# EAGLE schematic PotBreakout (EAGLE 6.5.0)
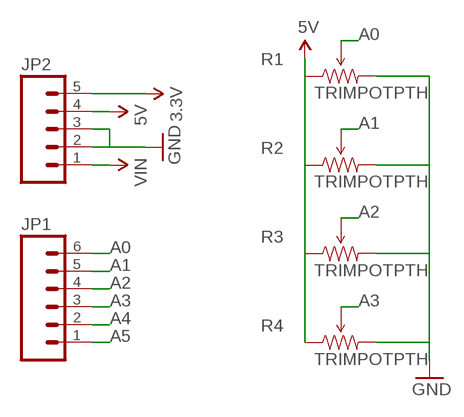
[diagram p0: schematic, sheet 1]

## Parts
JP1  M06SIP  [1X06]
JP2  M05NO_SILK  [1X05_NO_SILK]
R1  TRIMPOTPTH  [TRIM_POT_PTH]
R2  TRIMPOTPTH  [TRIM_POT_PTH]
R3  TRIMPOTPTH  [TRIM_POT_PTH]
R4  TRIMPOTPTH  [TRIM_POT_PTH]

## Nets
3.3V: JP2.5
5V: JP2.4 R1.1(CCW) R2.1(CCW) R3.1(CCW) R4.1(CCW)
A0: JP1.6 R1.2(WIPER)
A1: JP1.5 R2.2(WIPER)
A2: JP1.4 R3.2(WIPER)
A3: JP1.3 R4.2(WIPER)
A4: JP1.2
A5: JP1.1
GND: JP2.2 JP2.3 R1.3(CW) R2.3(CW) R3.3(CW) R4.3(CW)
VIN: JP2.1

## Library data of the parts
JP1 = SparkFun-Connectors:M06: Header 6 Standard 6-pin 0.1" header. Use with straight break away headers (SKU : PRT-00116), right angle break away headers (PRT-00553), swiss pins (PRT-00743), machine pins (PRT-00117), and female headers (PRT-00115). Molex polarized connector foot print use with SKU : PRT-08094 with associated crimp pins and housings. NOTES ON THE VARIANTS LOCK and LOCK_LONGPADS... This footprint was designed to help hold the alignment of a through-hole component (i.e. 6-pin header) while soldering it into place. You may notice that each hole has been shifted either up or down by 0.005 of an inch from it's more standard position (which is a perfectly straight line). This slight alteration caused the pins (the squares in the middle) to touch the edges of the holes. Because they are alternating, it causes a "brace" to hold the component in place. 0.005 has proven to be the perfect amount of "off-center" position when using our standard breakaway headers. Although looks a little odd when you look at the bare footprint, once you have a header in there, the alteration is very hard to notice. Also,if you push a header all the way into place, it is covered up entirely on the bottom side. This idea of altering the position of holes to aid alignment will be further integrated into the Sparkfun Library for other footprints. It can help hold any component with 3 or more connection pins.
JP2 = SparkFun-Connectors:M05: Header 5 Standard 5-pin 0.1" header. Use with straight break away headers (SKU : PRT-00116), right angle break away headers (PRT-00553), swiss pins (PRT-00743), machine pins (PRT-00117), and female headers (PRT-00115). Molex polarized connector foot print use with SKU : PRT-08230 with associated crimp pins and housings.
R1-R4 = SparkFun-Electromechanical:TRIMPOT: Various small potentiometers for "set-and-forget" applications